# Altium schematic sheet PWM_LED_RF.SchDoc
size 594 x 420 mm; Author: Казаков; PageSetup: Record=PageOptions|CenterHorizontal=True|CenterVertical=True|PrintScale=0.76|XCorrection=1.00|YCorrection=1.00|PrintKind=2|BorderSize=5000000|LeftOffset=0|BottomOffset=0|Orientation=2|PaperLength=1000|PaperWidth=1000|Scale=100|PaperSource=1|PrintQuality=600|MediaType=1|DitherType=10|PaperKind=A3|PrintScaleMode=1
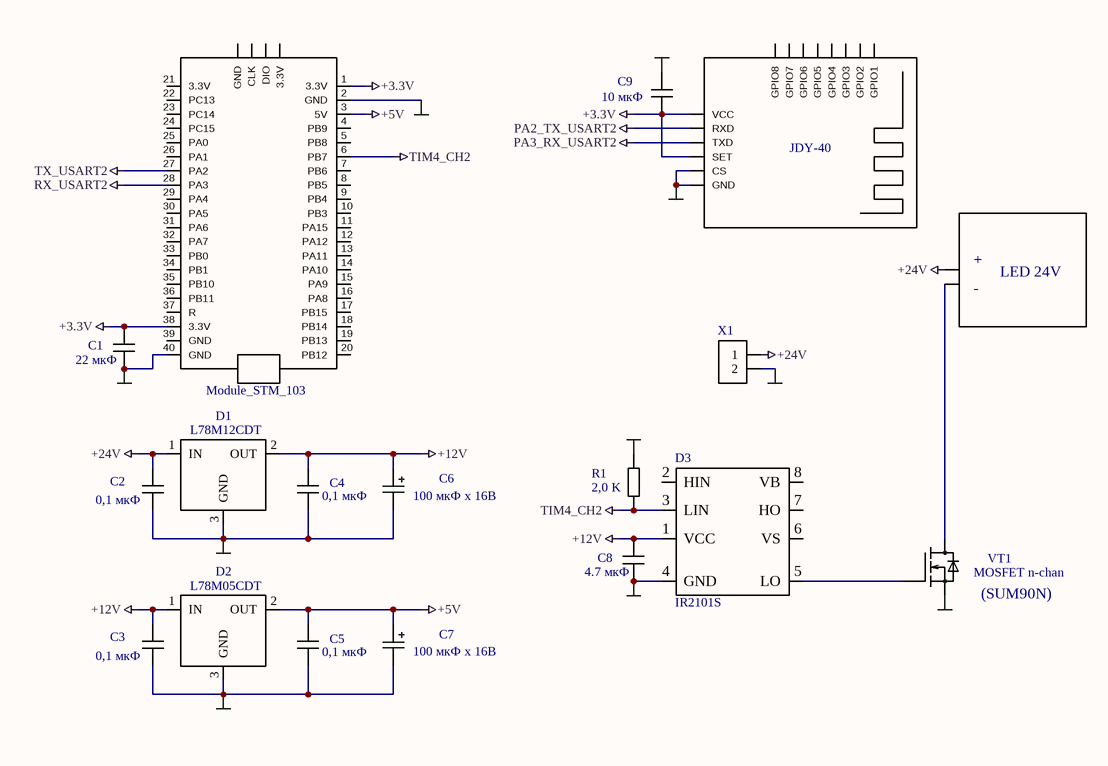
[diagram p0: PWM_LED_RF.SchDoc]

## Parts
(Parts that share a designator on the sheet are numbered #1, #2 ... from top to bottom, then left to right.)
*#1  Module_STM_103
*#2  JDY-40
C1  22 мкФ  [1210C]
C2  0,1 мкФ  [0603C]
C3  0,1 мкФ  [0603C]
C4  0,1 мкФ  [0603C]
C5  0,1 мкФ  [0603C]
C6  100 мкФ х 16В  [Cap_8x35]
C7  100 мкФ х 16В  [Cap_8x35]
C8  4.7 мкФ  [1210C]
C9  10 мкФ  [1210C]
D1  L78M12CDT  [D-Pak]
D2  L78M05CDT  [D-Pak]
D3  IR2101S
R1  2,0 K  [0603R]
VT1  MOSFET n-chan  [SOT23]
X1  CONT_2  [B2P-VH]  (value not drawn)

## Nets
+3.3V: *#1.1(3.3V) *#1.38(3.3V) *#2.9(VCC) *#2.12(SET) C1.2 C9.1
+5V: *#1.3(5V) C5.2 C7.1 D2.2(OUT)
+12V: C3.1 C4.2 C6.1 C8.2 D1.2(OUT) D2.1(IN) D3.1(VCC)
+24V: C2.1 D1.1(IN) X1.1
GND: *#1.2(GND) *#1.40(GND) *#2.13(CS) *#2.14(GND) C1.1 C2.2 C3.2 C4.1 C5.1 C6.2 C7.2 C8.1 C9.2 D1.3(GND) D2.3(GND) D3.4(GND) R1.2 VT1.2(S) X1.2
PA2_TX_USART2: *#2.10(RXD)
PA3_RX_USART2: *#2.11(TXD)
RX_USART2: *#1.28(PA3)
TIM4_CH2: *#1.6(PB7) D3.3(LIN) R1.1
TX_USART2: *#1.27(PA2)
NetD3_5: D3.5(LO) VT1.1(G)

Not connected (* = marked no-connect by the designer): *#1 4(PB9) 5(PB8) 7(PB6) 8(PB5) 9(PB4) 10(PB3) 11(PA15) 12(PA12) 13(PA11) 14(PA10) 15(PA9) 16(PA8) 17(PB15) 18(PB14) 19(PB13) 20(PB12) 21(3.3V) 22(PC13) 23(PC14) 24(PC15) 25(PA0) 26(PA1) 29(PA4) 30(PA5) 31(PA6) 32(PA7) 33(PB0) 34(PB1) 35(PB10) 36(PB11) 37(R) 39(GND); *#2 1(GPIO1) 2(GPIO2) 3(GPIO3) 4(GPIO4) 5(GPIO5) 6(GPIO6) 7(GPIO7) 8(GPIO8); D3 2(HIN) 6(VS) 7(HO) 8(VB); VT1 3(D)

## Notes on the sheet
- +
- -
- LED 24V
- (near VT1) (SUM90N)
- Labels drawn without touching a wire or pin: +24V
- Подп. и дата
- Инв. № дубл.
- Взам. инв. №
- Изм.
- Разраб.
- Лист
- № Докум.
- Подп.
- Дата
- Лит.
- Масса
- Масштаб
- Т. контр.
- Проверил
- Листов
- Инв. № подл.
- Утв.
- Н. контр.
- Копировал
- Формат А2

## Library data of the parts
C1-C5 C8 C9 = Capacitor
  C1: Value: 22 мкФ
  C2-C5: Value: 0,1 мкФ
  C8: Value: 4.7 мкФ
  C9: Value: 10 мкФ
C6 C7 = Capacitor+: Capacitor Polar; Value: 100 мкФ х 16В
D2 = L78M12CDT
R1 = Resistor: Value: 2,0 K
VT1 = MOSFET_n: name: MOSFET n-chan